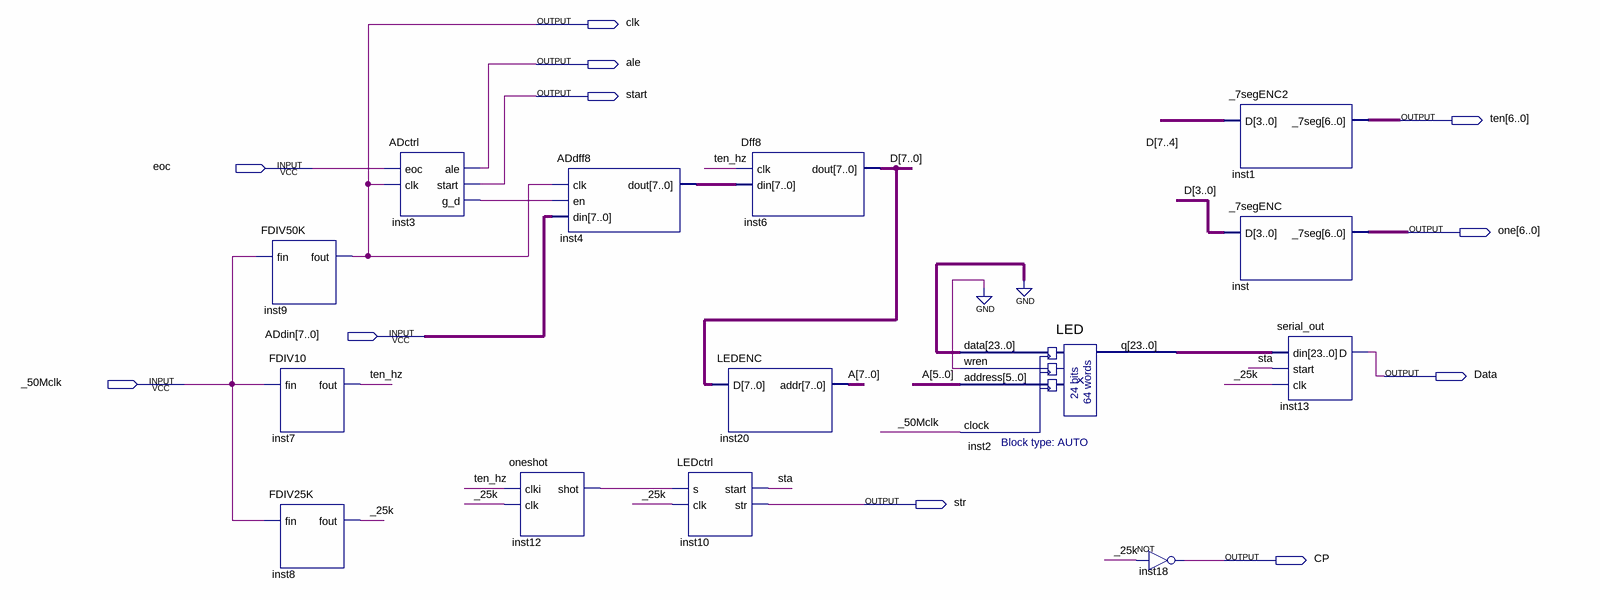
[diagram p0: schematic sheet]
// Quartus schematic hw6.bdf as structural Verilog: 14 symbols, 11 pins
module hw6 (
  input  eoc,
  input  [7:0] ADdin,
  input  _50Mclk,
  output clk,
  output ale,
  output start,
  output [6:0] ten,
  output [6:0] one,
  output Data,
  output str,
  output CP
);

  wire _25k, inst3_g_d, inst12_shot, sta, ten_hz;
  wire [7:0] A, D, inst4_dout;
  wire [23:0] inst2_q;

  FDIV50K inst9 (.fin(_50Mclk), .fout(clk));
  FDIV10 inst7 (.fin(_50Mclk), .fout(ten_hz));
  FDIV25K inst8 (.fin(_50Mclk), .fout(_25k));
  ADctrl inst3 (.eoc(eoc), .clk(clk), .ale(ale), .start(start), .g_d(inst3_g_d));
  oneshot inst12 (.clki(ten_hz), .clk(_25k), .shot(inst12_shot));
  ADdff8 inst4 (.clk(clk), .en(inst3_g_d), .din(ADdin), .dout(inst4_dout));
  LEDENC inst20 (.D(D), .addr(A));
  LEDctrl inst10 (.s(inst12_shot), .clk(_25k), .start(sta), .str(str));
  Dff8 inst6 (.clk(ten_hz), .din(inst4_dout), .dout(D));
  LED inst2 (.data({24{1'b0}}), .wren(1'b0), .address(A[5:0]), .clock(_50Mclk), .q(inst2_q));
  not inst18 (CP, _25k);
  _7segENC2 inst1 (.D(D[7:4]), ._7seg(ten));
  _7segENC inst (.D(D[3:0]), ._7seg(one));
  serial_out inst13 (.din(inst2_q), .start(sta), .clk(_25k), .D(Data));
endmodule
